# EAGLE design PwrBrd (EAGLE 9.2.2)
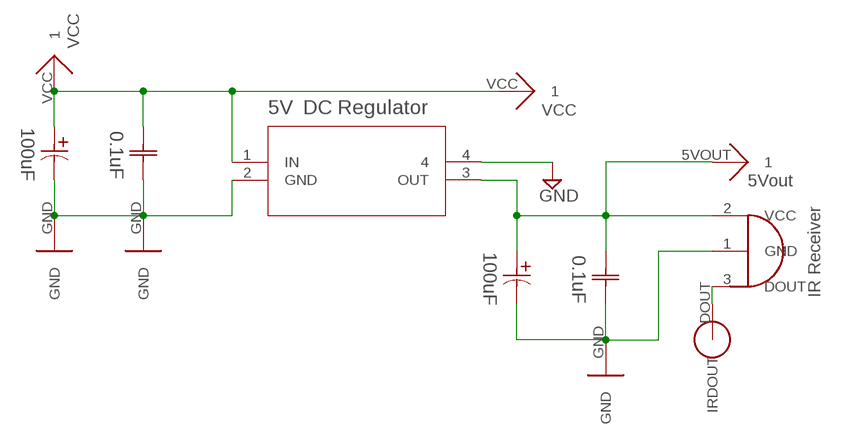
[diagram p0: schematic, sheet 1]

## Parts
C1  UPW1A101MDD  [PCAP_5X11-THRU-ELECT]
C2  UPW1A101MDD  [PCAP_5X11-THRU-ELECT]
C3  UVR2A0R1MDD  [U1-E]
C4  UVR2A0R1MDD  [U1-E]
U1  MIC5239-5.0YS  [SOT-223_S]
U$1  IRRECV  [IRRECV]
U$2  VCC  [VCC]
U$3  VCC  [VCC]
U$4  5VOUT  [5VOUT]
U$5  IRDOUT  [IRDOUT]
U$6  GND  [GND]
U$7  GND  [GND]
U$8  GND  [GND]

## Nets
GND: C1.2 C2.2 C3.2 C4.2 U1.2(GND) U1.4 U$1.1(GND) U$6.GND U$7.GND U$8.GND
N$1: C1.1 C3.1 U1.1(IN) U$2.VCC U$3.VCC
N$3: U$1.3(DOUT) U$5.DOUT(IRDOUT)
N$5: C2.1 C4.1 U1.3(OUT) U$1.2(VCC) U$4.5VOUT

## Library data of the parts
C1 C2 = DigiKeyParts:UPW1A101MDD: 100uF 10V; MANUFACTURER_PART_NUMBER: UPW1A101MDD; VENDOR: Nichicon
C3 C4 = DigiKeyParts:UVR2A0R1MDD: 0.1uF 100V; MANUFACTURER_PART_NUMBER: UVR2A0R1MDD; VENDOR: Nichicon
U1 = DigiKeyParts:MIC5239-5.0YS: 5V Regulator; MANUFACTURER_PART_NUMBER: MIC52395.0YS; VENDOR: Micrel
U$1 = DigiKeyParts:IRRECV: IR Reciever
U$2 U$3 = DigiKeyParts:VCC
U$4 = DigiKeyParts:5VOUT
U$5 = DigiKeyParts:IRDOUT
U$6-U$8 = DigiKeyParts:GND

## Net classes
0 default: width 0.5 mm, drill 0.35 mm, clearance 0.3 mm

## Board
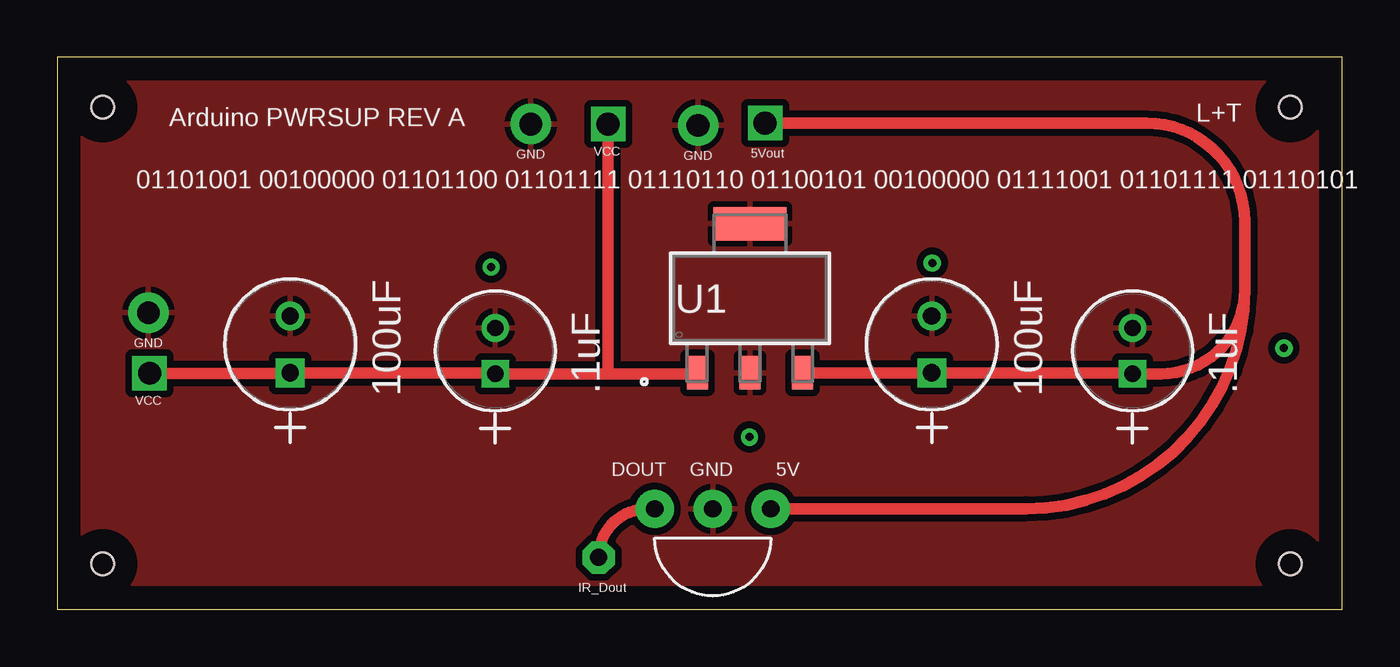
[diagram p1: board, top side]
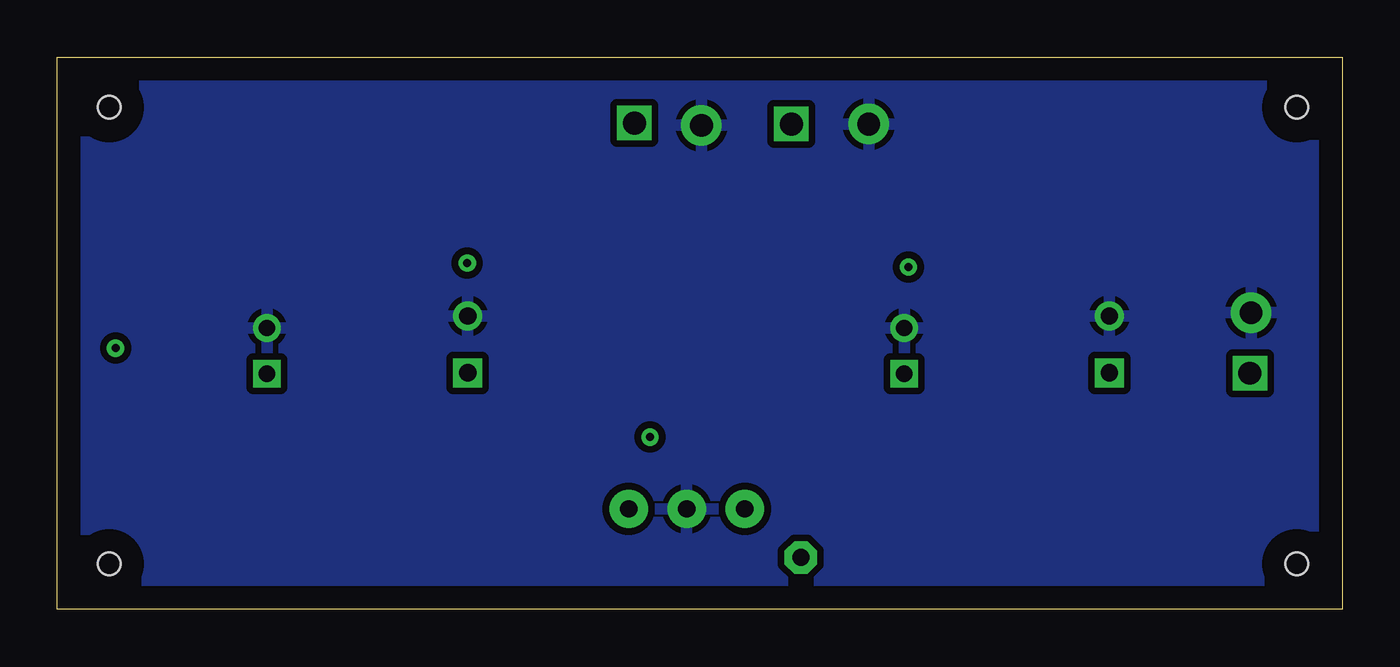
[diagram p2: board, bottom side, seen from below]

Size 56.28 x 24.2 mm. Coordinates in mm from the lower left corner, seen from the top.
Outline: 0,0 56.28,0 56.28,24.2 0,24.2 0,0
Copper layers (1*16): Top 0.035mm / dielectric 1.5mm / Bottom 0.035mm
Design rules "default": minimum track width 6mil, minimum drill 0.35mm, track to track 6mil, track to pad 6mil, pad to pad 6mil, via to via 6mil, smd to smd 6mil, copper to edge 40mil, drill to drill 6mil, minimum pad ring 10mil, minimum via ring 8mil, stop-mask expansion 4mil, vias tented up to drill 0mil, thermal gap 10mil
Holes 1 mm at 2,22 54,22 54,2 2,2

### Footprints (pad centres in the part's own frame; a part is rotated, then mirrored left to right if it is on the bottom)
PCAP_5X11-THRU-ELECT = drill 0.762 pad 1.27 square: 1 -2.489,0 | drill 0.762 pad 1.27: 2 0,0
U1-E = drill 0.711 pad 1.219 square: 1 -2.007,0 | drill 0.711 pad 1.219: 2 0,0
SOT-223_S = smd 0.914 x 1.473: 1 -2.3,-3.264; 2 0,-3.264; 3 2.3,-3.264 | smd 3.2 x 1.473: 4 0,3.264
IRRECV = drill 0.75 pad 1.676: 1 0,0; 2 -2.54,0; 3 2.54,0
VCC = drill 1 square: VCC 0,0
5VOUT = drill 1 square: 5VOUT 0,0
IRDOUT = drill 0.75 pad 1.422 octagon: DOUT 0,0
GND = drill 1 pad 1.778: GND 0,0

### Placement (x,y rotation side)
C1  10.21,12.86 90 top
C2  38.3,12.86 90 top
C3  19.19,12.33 90 top
C4  47.09,12.33 90 top
U1  30.34,13.64 0 top
U$1  28.71,4.41 180 top
U$2  4.05,10.35 0 top
U$3  24.13,21.26 0 top
U$4  31,21.31 0 top
U$5  23.71,2.28 0 top
U$6  4,13 0 top
U$7  20.74,21.26 0 top
U$8  28.07,21.21 0 top

### Tracks (layer width: path | path; a pad name or v marks a point on that pad's centre or on a via)
GND
  pour Top: -2,25 -2,-4 62,-4 62,25
  pour Bottom: -2,25 -2,-5 62,-5 62,25
N$1
  Top 0.5: C1.1 19.15,10.37 arc-90 C3.1
  Top 0.508: C3.1 24,10.33 | 24,10.33 27.99,10.33 U1.1 | U$3.VCC 24.13,10.45 24,10.33 | C1.1 arc-90 10.19,10.35 U$2.VCC
N$2  (via drill 0.35)
  other vias: 19,15
N$3
  Top 0.5: U$1.3 25.84,4.41 arc90 U$5.DOUT
N$4  (via drill 0.35)
  other vias: 38.32,15.18
N$5
  Top 0.5: U$1.2 42.41,4.41 arc90 52,14 | C2.1 47.05,10.37 arc-90 C4.1
  Top 0.508: U1.3 C2.1 | C4.1 48.33,10.33 arc90 52,14 52,17 arc90 47.69,21.31 U$4.5VOUT
N$6  (via drill 0.35)
  other vias: 53.72,11.45
N$7  (via drill 0.35)
  other vias: 30.32,7.56

### Text on the board
tPlace: Arduino PWRSUP REV A | L+T | 01101001 00100000 01101100 01101111 01110110 01100101 00100000 01111001 01101111 01110101